# EAGLE schematic SENSOR CAMERA 002 (EAGLE 5.10)
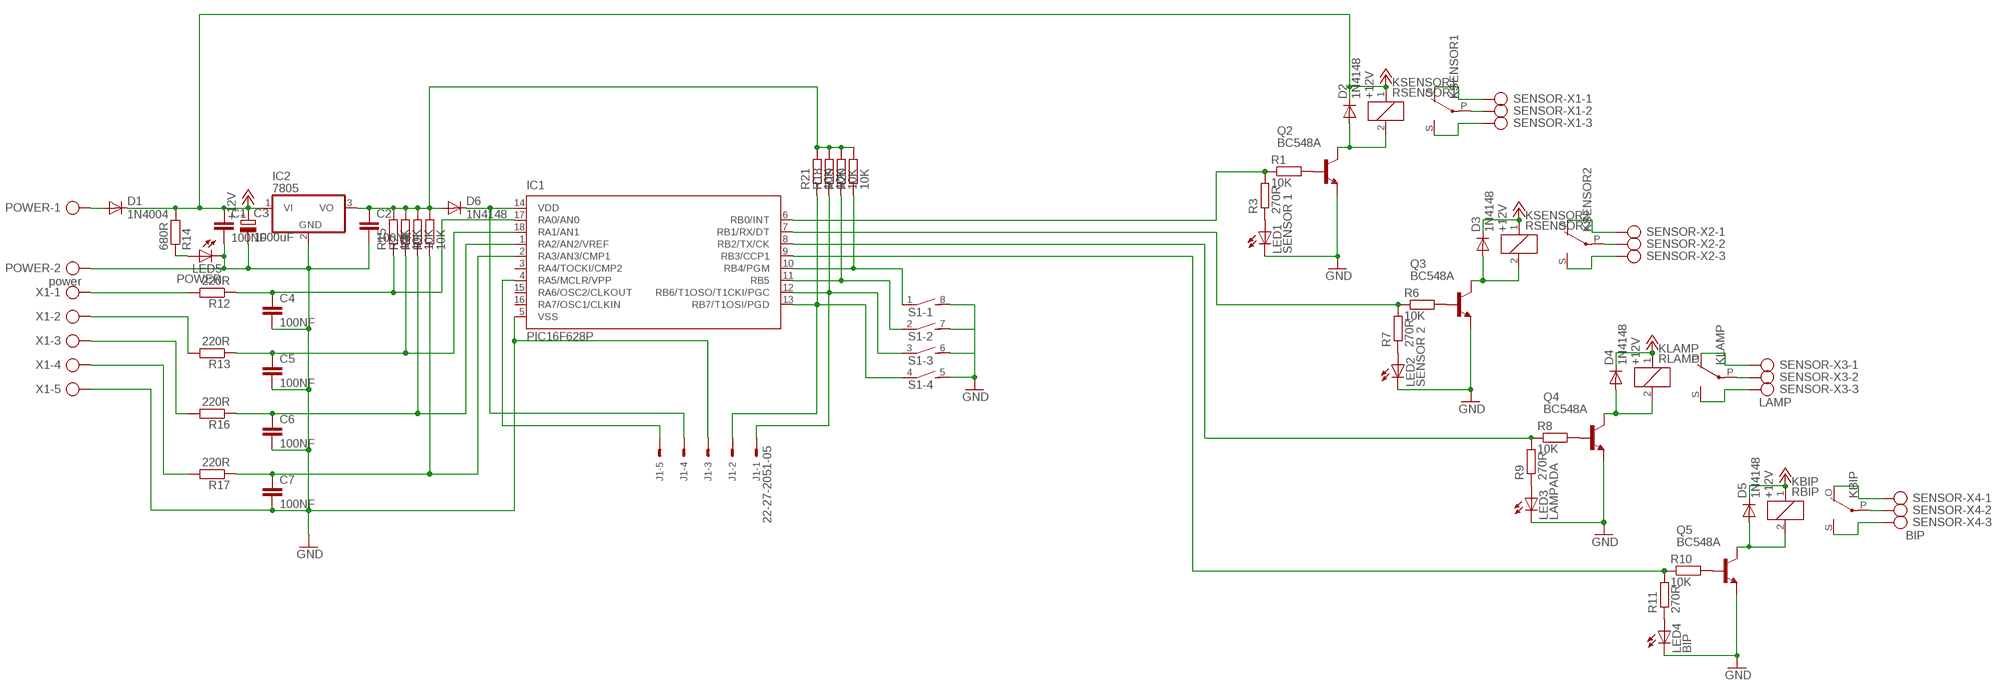
[diagram p0: schematic, sheet 1]

## Parts
C1  100NF  C-EU075-032X103  [C075-032X103]
C2  100NF  C-EU075-032X103  [C075-032X103]
C3  1000uF  CPOL-EUE5-10.5  [E5-10,5]
C4  100NF  C-EU075-032X103  [C075-032X103]
C5  100NF  C-EU075-032X103  [C075-032X103]
C6  100NF  C-EU075-032X103  [C075-032X103]
C7  100NF  C-EU075-032X103  [C075-032X103]
D1  1N4004  [DO41-10]
D2  1N4148  1N4148DO35-7  [DO35-7]
D3  1N4148  1N4148DO35-7  [DO35-7]
D4  1N4148  1N4148DO35-7  [DO35-7]
D5  1N4148  1N4148DO35-7  [DO35-7]
D6  1N4148  1N4148DO35-7  [DO35-7]
IC1  PIC16F628P  [DIL18]
IC2  7805  7805TV  [TO220V]
J1  22-27-2051-05  [6410-05]
KBIP  RBIP  G5LE  [G5LE]
KLAMP  RLAMP  G5LE  [G5LE]
KSENSOR1  RSENSOR1  G5LE  [G5LE]
KSENSOR2  RSENSOR2  G5LE  [G5LE]
LED1  SENSOR 1  LED5MM  [LED5MM]
LED2  SENSOR 2  LED5MM  [LED5MM]
LED3  LAMPADA  LED5MM  [LED5MM]
LED4  BIP  LED5MM  [LED5MM]
LED5  POWER  LED5MM  [LED5MM]
POWER  power  AK500/2-H  [AK500/2-H]
Q2  BC548A  [TO92-EBC]
Q3  BC548A  [TO92-EBC]
Q4  BC548A  [TO92-EBC]
Q5  BC548A  [TO92-EBC]
R1  10K  R-EU_0207/10  [0207/10]
R2  10K  R-EU_0207/10  [0207/10]
R3  270R  R-EU_0207/10  [0207/10]
R4  10K  R-EU_0207/10  [0207/10]
R5  10K  R-EU_0207/10  [0207/10]
R6  10K  R-EU_0207/10  [0207/10]
R7  270R  R-EU_0207/10  [0207/10]
R8  10K  R-EU_0207/10  [0207/10]
R9  270R  R-EU_0207/10  [0207/10]
R10  10K  R-EU_0207/10  [0207/10]
R11  270R  R-EU_0207/10  [0207/10]
R12  220R  R-EU_0207/10  [0207/10]
R13  220R  R-EU_0207/10  [0207/10]
R14  680R  R-EU_0207/10  [0207/10]
R15  10K  R-EU_0207/10  [0207/10]
R16  220R  R-EU_0207/10  [0207/10]
R17  220R  R-EU_0207/10  [0207/10]
R18  10K  R-EU_0207/10  [0207/10]
R19  10K  R-EU_0207/10  [0207/10]
R20  10K  R-EU_0207/10  [0207/10]
R21  10K  R-EU_0207/10  [0207/10]
S1  DIP04S  [DIP04S]
SENSOR-X1  AK500/3-H  [AK500/3-H]
SENSOR-X2  AK500/3-H  [AK500/3-H]
SENSOR-X3  LAMP  AK500/3-H  [AK500/3-H]
SENSOR-X4  BIP  AK500/3-H  [AK500/3-H]
X1  AK500/5-H  [AK500/5-H]

## Nets
+12V: C1.1 C3.+ D1.C D2.C D3.C D4.C D5.C IC2.1(VI) KBIP.1 KLAMP.1 KSENSOR1.1 KSENSOR2.1 R14.2
GND: C1.2 C2.2 C3.- C4.2 C5.2 C6.2 C7.2 IC1.5(VSS) IC2.2(GND) J1.3 LED1.K(C) LED2.K(C) LED3.K(C) LED4.K(C) LED5.K(C) POWER.2 Q2.E Q3.E Q4.E Q5.E S1.5 S1.6 S1.7 S1.8 X1.5
N$1: D1.A POWER.1
N$2: C6.1 IC1.1(RA2/AN2/VREF) R4.1 R16.1
N$3: IC1.6(RB0/INT) R1.1 R3.2
N$4: C2.1 D6.A IC2.3(VO) R2.2 R4.2 R5.2 R15.2 R18.2 R19.2 R20.2 R21.2
N$5: KSENSOR1.P(2:P) SENSOR-X1.2
N$6: KSENSOR1.O(2:O) SENSOR-X1.1
N$7: KSENSOR1.S(2:S) SENSOR-X1.3
N$8: D2.A KSENSOR1.2 Q2.C
N$9: LED1.A R3.1
N$10: Q2.B R1.2
N$11: C7.1 IC1.2(RA3/AN3/CMP1) R5.1 R17.1
N$12: C5.1 IC1.18(RA1/AN1) R2.1 R13.1
N$13: IC1.4(RA5/MCLR/VPP) J1.5
N$14: C4.1 IC1.17(RA0/AN0) R12.1 R15.1
N$15: IC1.10(RB4/PGM) R20.1 S1.1
N$16: KSENSOR2.P(2:P) SENSOR-X2.2
N$17: KSENSOR2.O(2:O) SENSOR-X2.1
N$18: KSENSOR2.S(2:S) SENSOR-X2.3
N$19: D3.A KSENSOR2.2 Q3.C
N$20: Q3.B R6.2
N$21: IC1.11(RB5) R19.1 S1.2
N$22: LED2.A R7.1
N$23: KLAMP.P(2:P) SENSOR-X3.2
N$24: KLAMP.O(2:O) SENSOR-X3.1
N$25: KLAMP.S(2:S) SENSOR-X3.3
N$26: D4.A KLAMP.2 Q4.C
N$27: Q4.B R8.2
N$28: IC1.8(RB2/TX/CK) R8.1 R9.2
N$29: LED3.A R9.1
N$30: KBIP.P(2:P) SENSOR-X4.2
N$31: KBIP.O(2:O) SENSOR-X4.1
N$32: KBIP.S(2:S) SENSOR-X4.3
N$33: D5.A KBIP.2 Q5.C
N$34: Q5.B R10.2
N$35: IC1.12(RB6/T1OSO/T1CKI/PGC) J1.1 R18.1 S1.3
N$36: LED4.A R11.1
N$37: IC1.9(RB3/CCP1) R10.1 R11.2
N$38: IC1.7(RB1/RX/DT) R6.1 R7.2
N$39: IC1.13(RB7/T1OSI/PGD) J1.2 R21.1 S1.4
N$40: LED5.A R14.1
N$42: R12.2 X1.1
N$43: R13.2 X1.2
N$44: R16.2 X1.3
N$45: R17.2 X1.4
N$48: D6.C IC1.14(VDD) J1.4
Unconnected: IC1.3(RA4/TOCKI/CMP2) IC1.15(RA6/OSC2/CLKOUT) IC1.16(RA7/OSC1/CLKIN)

## Library data of the parts
C1 C2 C4-C7 = rcl:C-EU: CAPACITOR, European symbol
C3 = rcl:CPOL-EU: POLARIZED CAPACITOR, European symbol
D1 = diode:1N4004: DIODE general purpose rectifier, 1 A
D2-D6 = diode:1N4148: DIODE high speed (Philips)
IC1 = microchip:PIC16F62*: FLASH-Based 8-Bit CMOS Microcontroller Source: http://ww1.microchip.com/downloads/en/DeviceDoc/40300C.pdf
IC2 = linear:78*: Positive VOLTAGE REGULATOR Source: http://cache.national.com/ds/LM/LM78L05.pdf http://www.fairchildsemi.com/ds/LM/LM7805.pdf
J1 = con-molex:22-?-05: CONNECTOR wire to board 2.54 mm (.1 inch) pitch header
KBIP KLAMP KSENSOR1 KSENSOR2 = relay:G5LE: RELAY 1 x switch, 10 A/120 V AC, 8 A/30 V DC, Omron
LED1-LED5 = led:LED: LED OSRAM: - CHIPLED LG R971, LG N971, LY N971, LG Q971, LY Q971, LO R971, LY R971 LH N974, LH R974 LS Q976, LO Q976, LY Q976 LO Q996 - Hyper CHIPLED LW Q18S LB Q993, LB Q99A, LB R99A - SideLED LS A670, LO A670, LY A670, LG A670, LP A670 LB A673, LV A673, LT A673, LW A673 LH A674 LY A675 LS A676, LA A676, LO A676, LY A676, LW A676 LS A679, LY A679, LG A679 - Hyper Micro SIDELED® LS Y876, LA Y876, LO Y876, LY Y876 LT Y87S - SmartLED LW L88C, LW L88S LB L89C, LB L89S, LG L890 LS L89K, LO L89K, LY L89K LS L896, LA L896, LO L896, LY L896 - TOPLED LS T670, LO T670, LY T670, LG T670, LP T670 LSG T670, LSP T670, LSY T670, LOP T670, LYG T670 LG T671, LOG T671, LSG T671 LB T673, LV T673, LT T673, LW T673 LH T674 LS T676, LA T676, LO T676, LY T676, LB T676, LH T676, LSB T676, LW T676 LB T67C, LV T67C, LT T67C, LS T67K, LO T67K, LY T67K, LW E67C LS E67B, LA E67B, LO E67B, LY E67B, LB E67C, LV E67C, LT E67C LW T67C LS T679, LY T679, LG T679 LS T770, LO T770, LY T770, LG T770, LP T770 LB T773, LV T773, LT T773, LW T773 LH T774 LS E675, LA E675, LY E675, LS T675 LS T776, LA T776, LO T776, LY T776, LB T776 LHGB T686 LT T68C, LB T68C - Hyper Mini TOPLED® LB M676 - Mini TOPLED Santana® LG M470 LS M47K, LO M47K, LY M47K Source: http://www.osram.convergy.de LUXEON: - LUMILED® LXK2-PW12-R00, LXK2-PW12-S00, LXK2-PW14-U00, LXK2-PW14-V00 LXK2-PM12-R00, LXK2-PM12-S00, LXK2-PM14-U00 LXK2-PE12-Q00, LXK2-PE12-R00, LXK2-PE12-S00, LXK2-PE14-T00, LXK2-PE14-U00 LXK2-PB12-K00, LXK2-PB12-L00, LXK2-PB12-M00, LXK2-PB14-N00, LXK2-PB14-P00, LXK2-PB14-Q00 LXK2-PR12-L00, LXK2-PR12-M00, LXK2-PR14-Q00, LXK2-PR14-R00 LXK2-PD12-Q00, LXK2-PD12-R00, LXK2-PD12-S00 LXK2-PH12-R00, LXK2-PH12-S00 LXK2-PL12-P00, LXK2-PL12-Q00, LXK2-PL12-R00 Source: www.luxeon.com KINGBRIGHT: KA-3528ASYC Source: www.kingbright.com
POWER = con-ptr500:AK500/2-H: CONNECTOR Aug. 2004 / PTR Meßtechnik: Die Bezeichnung der Serie AK505 wurde geändert. Es handelt sich hierbei um AK500 in horizontaler Ausführung.
Q2-Q5 = transistor-npn:BC548*: NPN Transistor
R1-R21 = rcl:R-EU_: RESISTOR, European symbol
S1 = switch-dil:DIP04S: DIL/CODE SWITCH
SENSOR-X1-SENSOR-X4 = con-ptr500:AK500/3-H: CONNECTOR Aug. 2004 / PTR Meßtechnik: Die Bezeichnung der Serie AK505 wurde geändert. Es handelt sich hierbei um AK500 in horizontaler Ausführung.
X1 = con-ptr500:AK500/5-H: CONNECTOR Aug. 2004 / PTR Meßtechnik: Die Bezeichnung der Serie AK505 wurde geändert. Es handelt sich hierbei um AK500 in horizontaler Ausführung.